# Altium schematic sheet USART&IrDA.SchDoc
size A4; Revision: C.2(PCB.SCH)
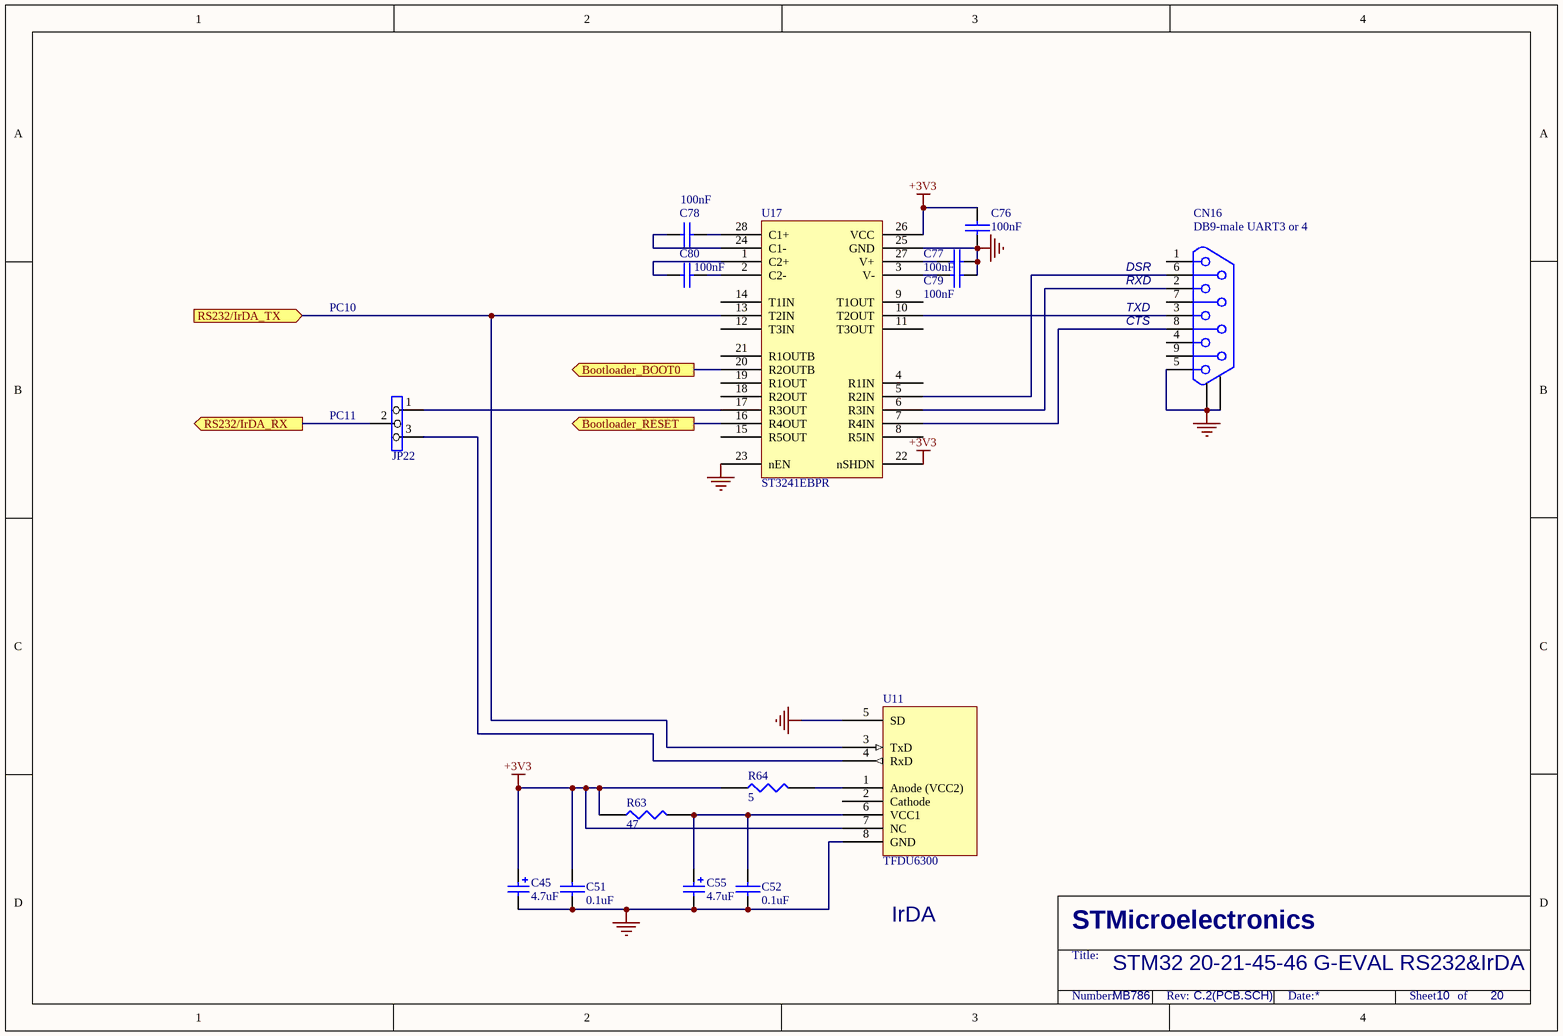
[diagram p0: USART&IrDA.SchDoc]

## Parts
C45  4.7uF  [TAN-A]
C51  0.1uF  [0402C]
C52  0.1uF  [0402C]
C55  4.7uF  [TAN-A]
C76  100nF  [0402C]
C77  100nF  [0402C]
C78  100nF  [0402C]
C79  100nF  [0402C]
C80  100nF  [0402C]
CN16  DB9-male UART3 or 4  [DB9/M]
JP22  (no value)  [SIP3]
R63  47  [0603R]
R64  5  [0603R]
U11  TFDU6300  [IR_VISHAY3]
U17  ST3241EBPR  [SSOP28]

## Ports
Bootloader_BOOT0 (out), Bootloader_RESET (out), RS232/IrDA_RX (out), RS232/IrDA_TX (in)

## Nets
+3V3: C45.1 C51.1 C76.2 R63.1 R64.1 U11.7(NC) U17.22(nSHDN) U17.26(VCC)
GND: C45.2 C51.2 C52.2 C55.2 C76.1 C77.2 C79.2 CN16.0 CN16.5 U11.5(SD) U11.8(GND) U17.23(nEN) U17.25(GND)
Bootloader_BOOT0: U17.20(R2OUTB) ; port Bootloader_BOOT0
Bootloader_RESET: U17.16(R4OUT) ; port Bootloader_RESET
RS232/IrDA_RX: JP22.2 ; port RS232/IrDA_RX
RS232/IrDA_TX: U11.3(TxD) U17.13(T2IN) ; port RS232/IrDA_TX
NetC52_1: C52.1 C55.1 R63.2 U11.6(VCC1)
NetC77_1: C77.1 U17.27(V+)
NetC78_1: C78.1 U17.24(C1-)
NetC78_2: C78.2 U17.28(C1+)
NetC79_1: C79.1 U17.3(V-)
NetC80_1: C80.1 U17.1(C2+)
NetC80_2: C80.2 U17.2(C2-)
NetCN16_2: CN16.2 U17.6(R3IN)
NetCN16_3: CN16.3 U17.10(T2OUT)
NetCN16_6: CN16.6 U17.5(R2IN)
NetCN16_8: CN16.8 U17.7(R4IN)
NetJP22_1: JP22.1 U17.17(R3OUT)
NetJP22_3: JP22.3 U11.4(RxD)
NetR64_2: R64.2 U11.1(Anode_(VCC2))

Not connected (* = marked no-connect by the designer): CN16 1 4 7 9; U11 2(Cathode); U17 4(R1IN) 8(R5IN) 9(T1OUT) 11(T3OUT) 12(T3IN) 14(T1IN) 15(R5OUT) 18(R2OUT) 19(R1OUT) 21(R1OUTB)

## Notes on the sheet
- PC10
- (near CN16) RXD
- (near CN16) TXD
- (near CN16) DSR
- (near CN16) CTS
- (near JP22) PC11
- IrDA
- STM32 20-21-45-46 G-EVAL RS232&IrDA
- MB786
- 10
- 20
- STMicroelectronics
- Title:
- Number:
- Rev:
- Date:
- Sheet       of

## Library data of the parts
C45 C55 = Cap Pol1: Polarized Capacitor (Radial); Value: 100pF; Published: 8-Jun-2000; Revision: July-2002: Re-released for DXP Platform.; Publisher: Altium Limited
C51 C52 C76-C80 = CAP: Capacitor
CN16 = DB9
JP22 = Jumper3
R63 R64 = RES1
U11 = TFDU4300
U17 = ST3241